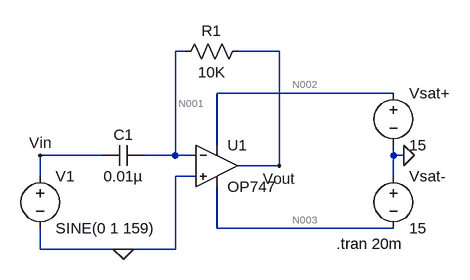
[diagram p0: schematic DIFFERENTIATOR_IDEAL.asc]
DIFFERENTIATOR_IDEAL.asc, the LTspice schematic file:
Version 4
SHEET 1 1584 680
WIRE 336 -16 320 -16
WIRE 480 -16 416 -16
WIRE 656 48 384 48
WIRE 384 128 384 48
WIRE 208 144 112 144
WIRE 320 144 320 -16
WIRE 320 144 272 144
WIRE 352 144 320 144
WIRE 656 144 656 128
WIRE 672 144 656 144
WIRE 480 160 480 -16
WIRE 480 160 416 160
WIRE 112 176 112 144
WIRE 352 176 320 176
WIRE 656 176 656 144
WIRE 384 256 384 192
WIRE 656 256 384 256
WIRE 112 288 112 256
WIRE 240 288 112 288
WIRE 320 288 320 176
WIRE 320 288 240 288
FLAG 672 144 0
FLAG 240 288 0
FLAG 112 144 Vin
FLAG 480 160 Vout
SYMBOL OpAmps\\OP747 384 96 R0
SYMATTR InstName U1
SYMBOL voltage 656 32 R0
WINDOW 123 0 0 Left 0
WINDOW 39 0 0 Left 0
SYMATTR InstName Vsat+
SYMATTR Value 15
SYMBOL voltage 656 160 R0
WINDOW 123 0 0 Left 0
WINDOW 39 0 0 Left 0
SYMATTR InstName Vsat-
SYMATTR Value 15
SYMBOL cap 272 128 R90
WINDOW 0 0 32 VBottom 2
WINDOW 3 32 32 VTop 2
SYMATTR InstName C1
SYMATTR Value 0.01µ
SYMBOL res 432 -32 R90
WINDOW 0 0 56 VBottom 2
WINDOW 3 32 56 VTop 2
SYMATTR InstName R1
SYMATTR Value 10K
SYMBOL voltage 112 160 R0
WINDOW 123 0 0 Left 0
WINDOW 39 0 0 Left 0
SYMATTR InstName V1
SYMATTR Value SINE(0 1 159)
TEXT 568 280 Left 2 !.tran 20m

The netlist it stands for:
* DIFFERENTIATOR_IDEAL.asc
XU1 0 N001 N002 N003 Vout OP747  ; pins In+ In- V+ V- OUT
Vsat+ N002 0 15
Vsat- 0 N003 15
C1 N001 Vin 0.01µ
R1 Vout N001 10K
V1 Vin 0 SINE(0 1 159)
.tran 20m
.backanno
.end

* Results of the author's LTspice run, read from the files saved beside the schematic
* Operating Point, zero values left out:
*   V(n001) = 80 µV
*   V(n003) = -15 V
*   V(n002) = 15 V
*   V(vout) = -8.564 µV
*   I(R1) = -8.856 nA
*   I(Vsat-) = -304.4 µA
*   I(Vsat+) = -304.4 µA
*   Ix(u1:1) = -10.86 nA
*   Ix(u1:2) = -8.856 nA
*   Ix(u1:99) = 304.4 µA
*   Ix(u1:50) = -304.4 µA
*   Ix(u1:45) = 8.856 nA
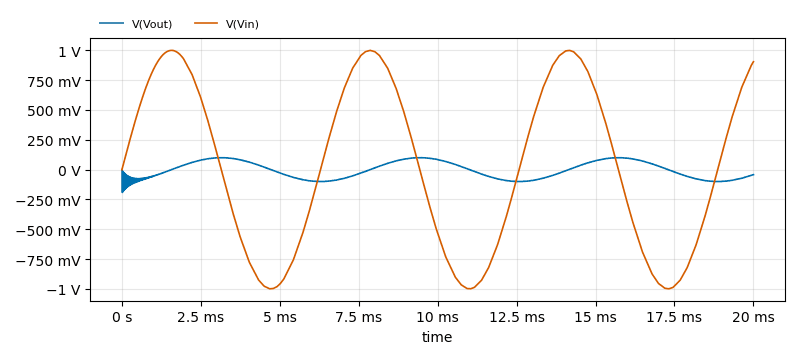
[diagram p1: Transient Analysis of DIFFERENTIATOR_IDEAL.asc, plotted from the saved traces]
* Transient Analysis, 1 run:
*   V(Vout): min -191.3 mV, max 99.89 mV, average -4.529 mV, rms 71.52 mV, last -42.57 mV
*   V(Vin): min -999.5 mV, max 1 V, average 28.89 mV, rms 700.3 mV, last 904.8 mV